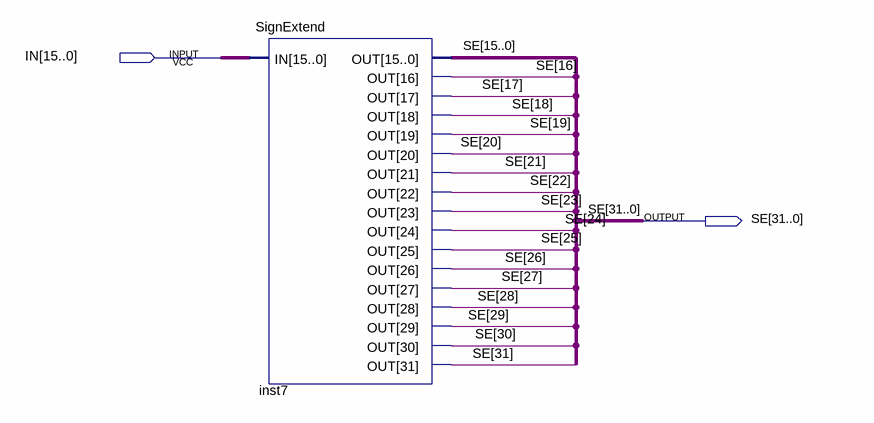
[diagram p0: schematic sheet]
// Quartus schematic SignExtendPro.bdf as structural Verilog: 1 symbols, 2 pins
module SignExtendPro (
  input  [15:0] IN,
  output [31:0] SE
);

  SignExtend inst7 (.IN(IN), .OUT(SE));
endmodule
